# Altium schematic sheet MicroSD.SchDoc
size B
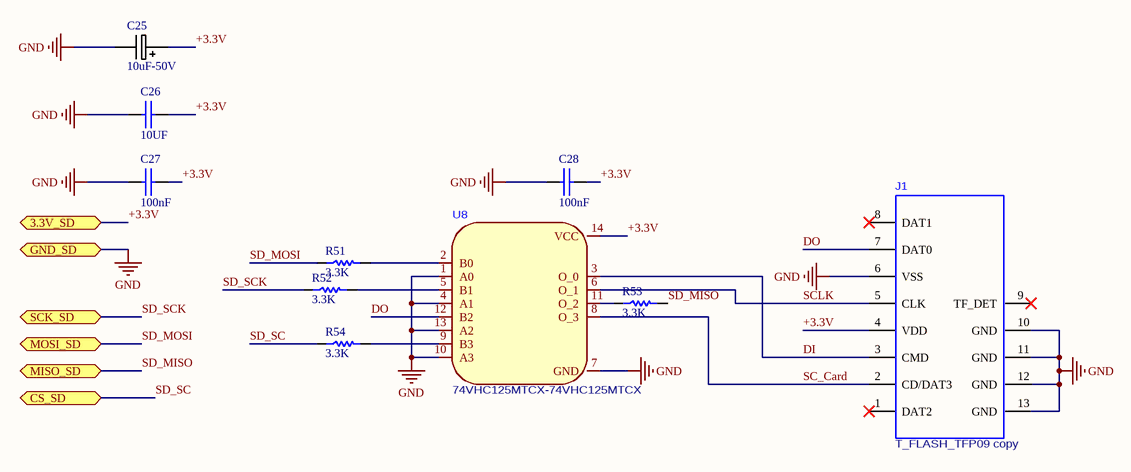
[diagram p0: MicroSD.SchDoc]

## Parts
C25  10uF-50V  [PANACAP-D-GENERIC]
C26  10UF  [SMD_CAP_0805]
C27  100nF  [SMD_CAP_0805]
C28  100nF  [SMD_CAP_0805]
J1  T_FLASH_TFP09 copy  [TFP09-2-12B-MOD]
R51  3.3K  [RES 0805 (2012X06L)]
R52  3.3K  [RES 0805 (2012X06L)]
R53  3.3K  [RES 0805 (2012X06L)]
R54  3.3K  [RES 0805 (2012X06L)]
U8  74VHC125MTCX-74VHC125MTCX  [SOP65P640X120-14N]

## Ports
3.3V_SD (bidir), CS_SD (bidir), GND_SD (bidir), MISO_SD (bidir), MOSI_SD (bidir), SCK_SD (bidir)

## Nets
GND: C25.- C26.1(+) C27.1(+) C28.1(+) J1.6(VSS) J1.10(GND) J1.11(GND) J1.12(GND) J1.13(GND) U8.1(A0) U8.4(A1) U8.7(GND) U8.10(A3) U8.13(A2) ; port GND_SD
+3.3V: C25.+ C26.2(-) C27.2(-) C28.2(-) J1.4(VDD) U8.14(VCC) ; port 3.3V_SD
DI: J1.3(CMD) U8.3(O_0)
DO: J1.7(DAT0) U8.12(B2)
SC_Card: J1.2(CD/DAT3) U8.8(O_3)
SCLK: J1.5(CLK) U8.6(O_1)
SD_MISO: R53.2 ; port MISO_SD
SD_MOSI: R51.1 ; port MOSI_SD
SD_SC: R54.1 ; port CS_SD
SD_SCK: R52.1 ; port SCK_SD
NetR51_2: R51.2 U8.2(B0)
NetR52_2: R52.2 U8.5(B1)
NetR53_1: R53.1 U8.11(O_2)
NetR54_2: R54.2 U8.9(B3)

Not connected (* = marked no-connect by the designer): J1 1(DAT2)* 8(DAT1)* 9(TF_DET)*

## Library data of the parts
C25 = PANACAP-10UF-50V-FK: GENERIC CAPACITOR POLARISED; Supplier 1: Digi-Key; Supplier Part Number 1: PCE3807TR-ND
C26-C28 = Cap-Bipolar: Bipolar Capacitor; Voltage: 100V; Designer: Saeid Jorablo; Organazation: ControTec; Adding Date: 1387/12/20
  C26: Value: 10UF
  C27 C28: Value: 100nF
R51-R54 = Resistor: Tolerance: 5%; Power: 1/8 W; Value: 3.3K